# Altium schematic sheet Host-Interface.SchDoc: Shepherd - Host Interface
size 381 x 241 mm; Author: Ingmar; CompanyName: NES Lab / TU Dresden; DocumentNumber: 3; SheetNumber: 3; SheetTotal: 8
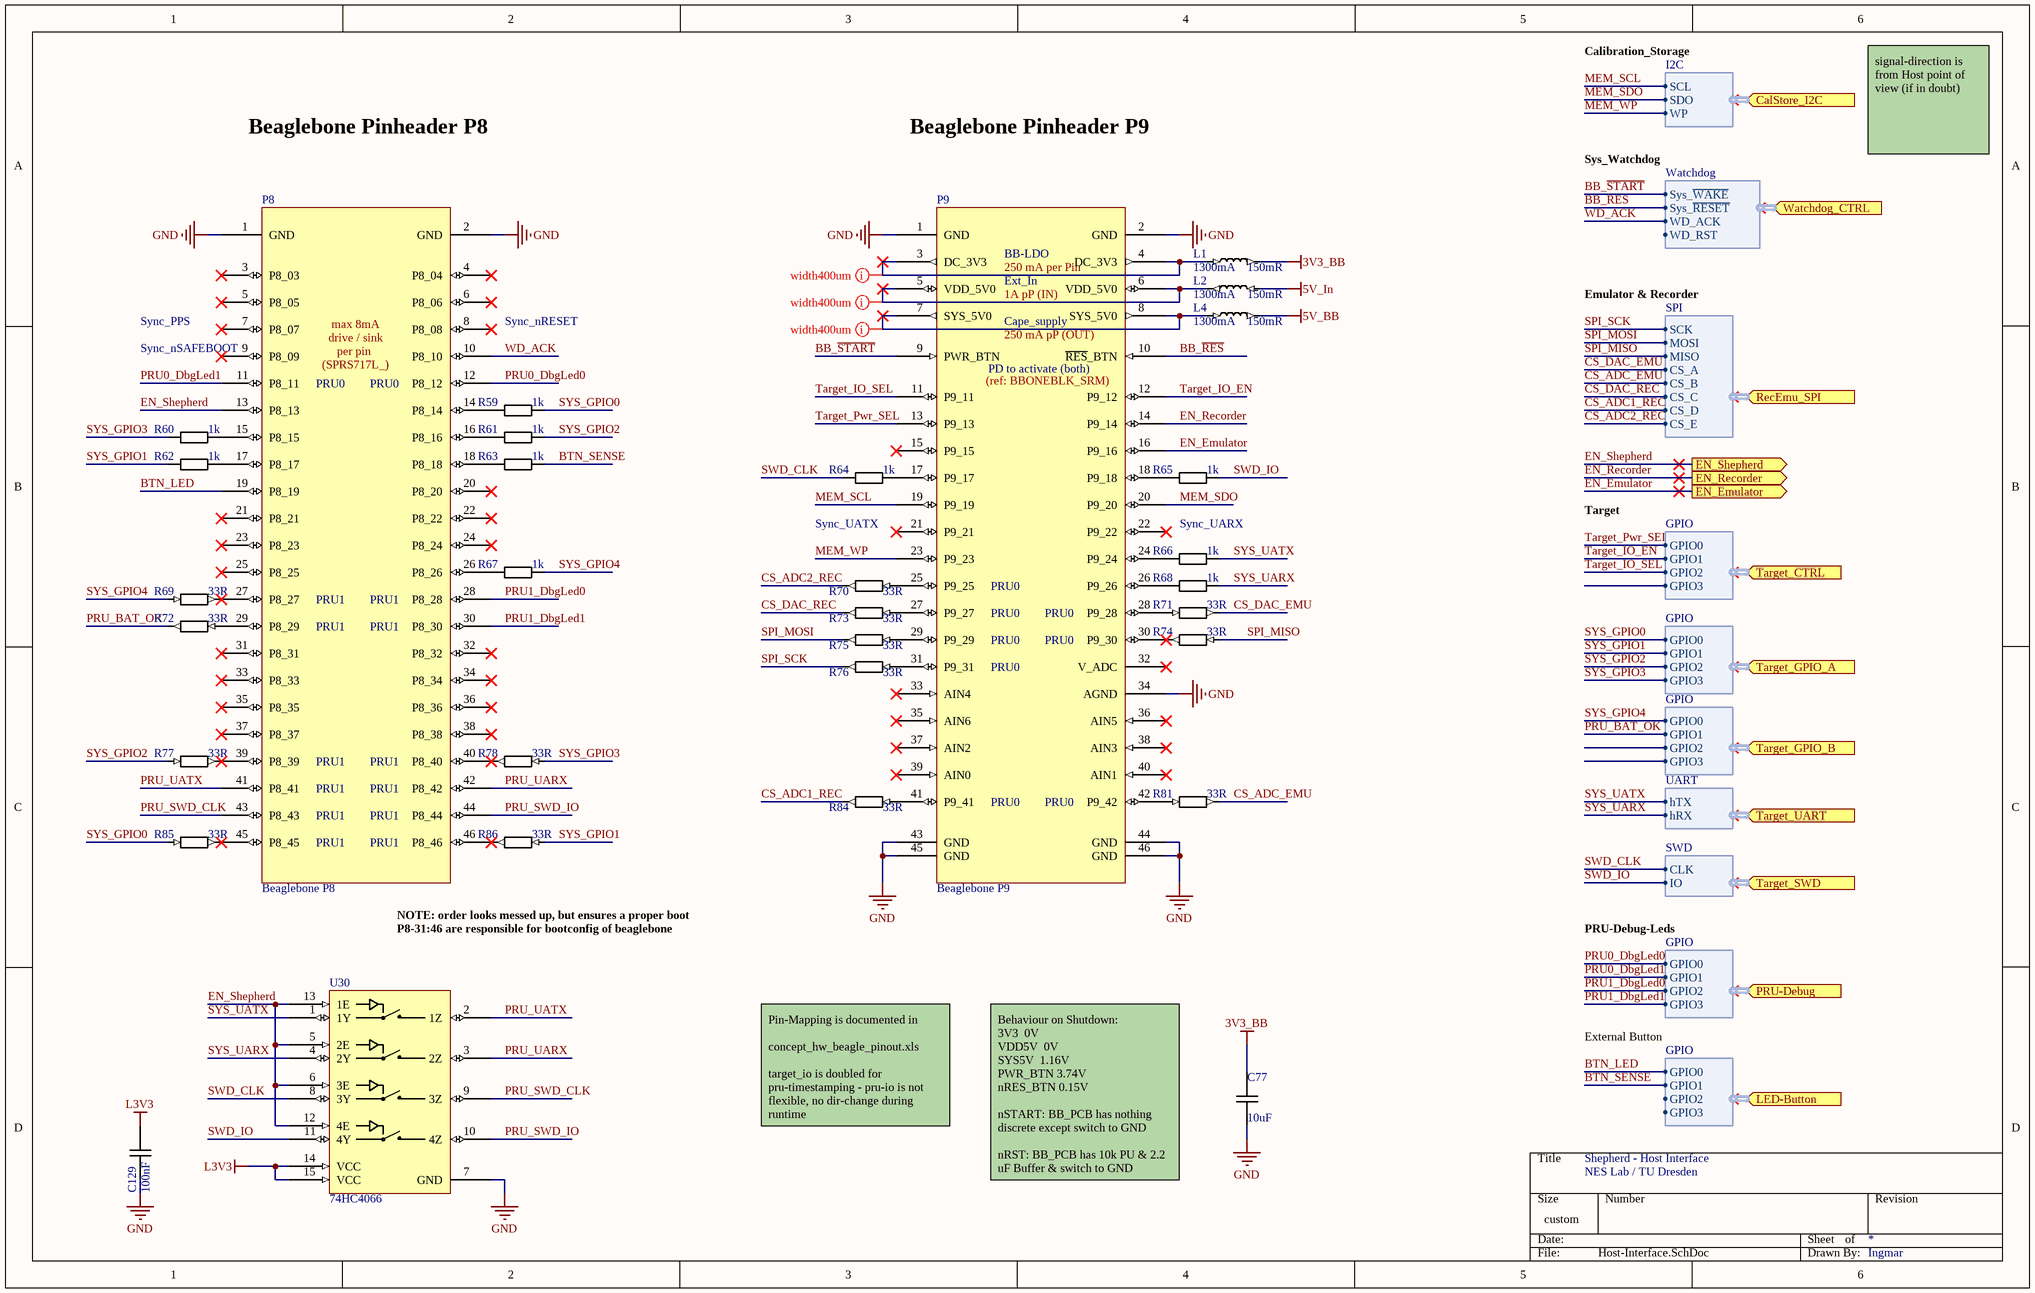
[diagram p0: Host-Interface.SchDoc]

## Parts
C77  value 10uF  [CAPC1608X09]  (hidden comment: C_0603_10uF_16V)
C129  value 100nF  [CAPC1005X06]  (hidden comment: C_0402_100nF_16V)
L1  value 150mR  I_max: 1300mA  [INDC1608X08]  (hidden comment: FB_0603_Z600R_1300mA)
L2  value 150mR  I_max: 1300mA  [INDC1608X08]  (hidden comment: FB_0603_Z600R_1300mA)
L4  value 150mR  I_max: 1300mA  [INDC1608X08]  (hidden comment: FB_0603_Z600R_1300mA)
P8  Beaglebone P8  [P_Pinheader_2x23_R2.54mm_LongPinHeader]
P9  Beaglebone P9  [P_Pinheader_2x23_R2.54mm_LongPinHeader]
R59  value 1k  [RESC1005X04]  (hidden comment: R_0402_1k)
R60  value 1k  [RESC1005X04]  (hidden comment: R_0402_1k)
R61  value 1k  [RESC1005X04]  (hidden comment: R_0402_1k)
R62  value 1k  [RESC1005X04]  (hidden comment: R_0402_1k)
R63  value 1k  [RESC1005X04]  (hidden comment: R_0402_1k)
R64  value 1k  [RESC1005X04]  (hidden comment: R_0402_1k)
R65  value 1k  [RESC1005X04]  (hidden comment: R_0402_1k)
R66  value 1k  [RESC1005X04]  (hidden comment: R_0402_1k)
R67  value 1k  [RESC1005X04]  (hidden comment: R_0402_1k)
R68  value 1k  [RESC1005X04]  (hidden comment: R_0402_1k)
R69  value 33R  [RESC1005X04]  (hidden comment: R_0402_33R)
R70  value 33R  [RESC1005X04]  (hidden comment: R_0402_33R)
R71  value 33R  [RESC1005X04]  (hidden comment: R_0402_33R)
R72  value 33R  [RESC1005X04]  (hidden comment: R_0402_33R)
R73  value 33R  [RESC1005X04]  (hidden comment: R_0402_33R)
R74  value 33R  [RESC1005X04]  (hidden comment: R_0402_33R)
R75  value 33R  [RESC1005X04]  (hidden comment: R_0402_33R)
R76  value 33R  [RESC1005X04]  (hidden comment: R_0402_33R)
R77  value 33R  [RESC1005X04]  (hidden comment: R_0402_33R)
R78  value 33R  [RESC1005X04]  (hidden comment: R_0402_33R)
R81  value 33R  [RESC1005X04]  (hidden comment: R_0402_33R)
R84  value 33R  [RESC1005X04]  (hidden comment: R_0402_33R)
R85  value 33R  [RESC1005X04]  (hidden comment: R_0402_33R)
R86  value 33R  [RESC1005X04]  (hidden comment: R_0402_33R)
U30  74HC4066  [PQFN50P250X300X100_HS-15N]

## Ports
CalStore_I2C (in, harness I2C), EN_Emulator (out), EN_Recorder (out), EN_Shepherd (out), LED-Button (in, harness GPIO), PRU-Debug (in, harness GPIO), RecEmu_SPI (in, harness SPI), Target_CTRL (in, harness GPIO), Target_GPIO_A (in, harness GPIO), Target_GPIO_B (in, harness GPIO), Target_SWD (in, harness SWD), Target_UART (in, harness UART), Watchdog_CTRL (in, harness Watchdog)

## Harnesses
GPIO: GPIO0, GPIO1, GPIO2, GPIO3
SWD: CLK, IO
UART: hTX, hRX
I2C: SCL, SDO, WP
SPI: SCK, MOSI, MISO, CS_A, CS_B, CS_C, CS_D, CS_E
Watchdog: Sys_~{WAKE}, Sys_~{RESET}, WD_ACK, WD_RST

## Nets
3V3_BB: C77.2 L1.2
5V_BB: L4.2
5V_In: L2.1
GND: C77.1 C129.2 P8.1(GND) P8.2(GND) P9.1(GND) P9.2(GND) P9.34(AGND) P9.43(GND) P9.44(GND) P9.45(GND) P9.46(GND) U30.7(GND)
L3V3: C129.1 U30.14(VCC) U30.15(VCC)
BB_~{RES}: P9.10(~{RES}_BTN) ; port Watchdog_CTRL.Sys_~{RESET}
BB_~{START}: P9.9(PWR_BTN) ; port Watchdog_CTRL.Sys_~{WAKE}
BTN_LED: P8.19(P8_19) ; port LED-Button.GPIO0
BTN_SENSE: R63.2 ; port LED-Button.GPIO1
CS_ADC1_REC: R84.2 ; port RecEmu_SPI.CS_D
CS_ADC2_REC: R70.2 ; port RecEmu_SPI.CS_E
CS_ADC_EMU: R81.2 ; port RecEmu_SPI.CS_B
CS_DAC_EMU: R71.2 ; port RecEmu_SPI.CS_A
CS_DAC_REC: R73.2 ; port RecEmu_SPI.CS_C
EN_Emulator: P9.16(P9_16) ; port EN_Emulator
EN_Recorder: P9.14(P9_14) ; port EN_Recorder
EN_Shepherd: P8.13(P8_13) U30.5(2E) U30.6(3E) U30.12(4E) U30.13(1E) ; port EN_Shepherd
MEM_SCL: P9.19(P9_19) ; port CalStore_I2C.SCL
MEM_SDO: P9.20(P9_20) ; port CalStore_I2C.SDO
MEM_WP: P9.23(P9_23) ; port CalStore_I2C.WP
PRU0_DbgLed0: P8.12(P8_12) ; port PRU-Debug.GPIO0
PRU0_DbgLed1: P8.11(P8_11) ; port PRU-Debug.GPIO1
PRU1_DbgLed0: P8.28(P8_28) ; port PRU-Debug.GPIO2
PRU1_DbgLed1: P8.30(P8_30) ; port PRU-Debug.GPIO3
PRU_BAT_OK: R72.2 ; port Target_GPIO_B.GPIO1
PRU_SWD_CLK: P8.43(P8_43) U30.9(3Z)
PRU_SWD_IO: P8.44(P8_44) U30.10(4Z)
PRU_UARX: P8.42(P8_42) U30.3(2Z)
PRU_UATX: P8.41(P8_41) U30.2(1Z)
SPI_MISO: R74.1 ; port RecEmu_SPI.MISO
SPI_MOSI: R75.2 ; port RecEmu_SPI.MOSI
SPI_SCK: R76.2 ; port RecEmu_SPI.SCK
SWD_CLK: R64.1 U30.8(3Y) ; port Target_SWD.CLK
SWD_IO: R65.2 U30.11(4Y) ; port Target_SWD.IO
SYS_GPIO0: R59.2 R85.1 ; port Target_GPIO_A.GPIO0
SYS_GPIO1: R62.1 R86.1 ; port Target_GPIO_A.GPIO1
SYS_GPIO2: R61.2 R77.1 ; port Target_GPIO_A.GPIO2
SYS_GPIO3: R60.1 R78.1 ; port Target_GPIO_A.GPIO3
SYS_GPIO4: R67.2 R69.1 ; port Target_GPIO_B.GPIO0
SYS_UARX: R68.2 U30.4(2Y) ; port Target_UART.hRX
SYS_UATX: R66.2 U30.1(1Y) ; port Target_UART.hTX
Target_IO_EN: P9.12(P9_12) ; port Target_CTRL.GPIO1
Target_IO_SEL: P9.11(P9_11) ; port Target_CTRL.GPIO2
Target_Pwr_SEL: P9.13(P9_13) ; port Target_CTRL.GPIO0
WD_ACK: P8.10(P8_10) ; port Watchdog_CTRL.WD_ACK
NetL1_1: L1.1 P9.3(DC_3V3) P9.4(DC_3V3)
NetL2_2: L2.2 P9.5(VDD_5V0) P9.6(VDD_5V0)
NetL4_1: L4.1 P9.7(SYS_5V0) P9.8(SYS_5V0)
NetP8_14: P8.14(P8_14) R59.1
NetP8_15: P8.15(P8_15) R60.2
NetP8_16: P8.16(P8_16) R61.1
NetP8_17: P8.17(P8_17) R62.2
NetP8_18: P8.18(P8_18) R63.1
NetP8_26: P8.26(P8_26) R67.1
NetP8_27: P8.27(P8_27) R69.2
NetP8_29: P8.29(P8_29) R72.1
NetP8_39: P8.39(P8_39) R77.2
NetP8_40: P8.40(P8_40) R78.2
NetP8_45: P8.45(P8_45) R85.2
NetP8_46: P8.46(P8_46) R86.2
NetP9_17: P9.17(P9_17) R64.2
NetP9_18: P9.18(P9_18) R65.1
NetP9_24: P9.24(P9_24) R66.1
NetP9_25: P9.25(P9_25) R70.1
NetP9_26: P9.26(P9_26) R68.1
NetP9_27: P9.27(P9_27) R73.1
NetP9_28: P9.28(P9_28) R71.1
NetP9_29: P9.29(P9_29) R75.1
NetP9_30: P9.30(P9_30) R74.2
NetP9_31: P9.31(P9_31) R76.1
NetP9_41: P9.41(P9_41) R84.1
NetP9_42: P9.42(P9_42) R81.1

Not connected (* = marked no-connect by the designer): P8 3(P8_03)* 4(P8_04)* 5(P8_05)* 6(P8_06)* 7(P8_07)* 8(P8_08)* 9(P8_09)* 20(P8_20)* 21(P8_21)* 22(P8_22)* 23(P8_23)* 24(P8_24)* 25(P8_25)* 31(P8_31)* 32(P8_32)* 33(P8_33)* 34(P8_34)* 35(P8_35)* 36(P8_36)* 37(P8_37)* 38(P8_38)*; P9 15(P9_15)* 21(P9_21)* 22(P9_22)* 32(V_ADC)* 33(AIN4)* 35(AIN6)* 36(AIN5)* 37(AIN2)* 38(AIN3)* 39(AIN0)* 40(AIN1)*

## Layout directives
rule Width Constraint [Pref Width = 0.4mm    Min Width = 0.4mm    Max Width = 1mm]: NetL1_1, NetL2_2, NetL4_1

## Notes on the sheet
- Calibration_Storage
- Beaglebone Pinheader P8
- Beaglebone Pinheader P9
- Sys_Watchdog
- signal-direction is from Host point of view (if in doubt)
- Emulator & Recorder
- Sync_PPS
- (near P8) Sync_nSAFEBOOT
- Sync_nRESET
- (near P8) PRU0
- Sync_UATX
- Sync_UARX
- Target
- (near P8) PRU1
- (near P9) PRU0
- NOTE: order looks messed up, but ensures a proper boot
- P8-31:46 are responsible for bootconfig of beaglebone
- PRU-Debug-Leds
- External Button
- Pin-Mapping is documented in
  concept_hw_beagle_pinout.xls
  target_io is doubled for pru-timestamping - pru-io is not flexible, no dir-change during runtime
- Behaviour on Shutdown:
  3V3		0V
  VDD5V		0V
  SYS5V		1.16V
  PWR_BTN	3.74V
  nRES_BTN	0.15V
  nSTART: BB_PCB has nothing discrete except switch to GND
  nRST: BB_PCB has 10k PU & 2.2 uF Buffer & switch to GND
- (in symbol Beaglebone P8) max 8mA / drive / sink / per pin / (SPRS717L_)
- (in symbol Beaglebone P9) BB-LDO; 250 mA per Pin; Ext_In; 1A pP (IN); Cape_supply; 250 mA pP (OUT); PD to activate (both); (ref: BBONEBLK_SRM)

## Library data of the parts
C77 = .C_0603_10uF_16V: Capacitor; Manufacturer: Taiyo Yuden; Manufacturer PN: EMK107BBJ106MA-T; V_max: 16V; Tolerance: 20%; Dielectric: X5R; Distributer: Mouser; Distributer PN: 963-EMK107BBJ106MA-T; Price n10 [€]: 0.14
C129 = .C_0402_100nF_16V: Capacitor; Manufacturer: Taiyo Yuden; Manufacturer PN: EMF105B7104MVHF; V_max: 16V; Tolerance: 20%; Dielectric: X7R; Distributer: Mouser; Distributer PN: 963-EMF105B7104MVHF; Price n10 [€]: 0.03
L1 L2 L4 = .L_FB_0603_Z600R_1300mA: Ferrite Bead, 600 Ohm @ 100 MHz,; Manufacturer: Murata; Manufacturer PN: BLM18KG601SN1D; Tolerance: 25 %; Distributer: Mouser; Distributer PN: 81-BLM18KG601SN1D; Price n10 [€]: 0.05
P8 = Beaglebone P8: Manufacturer: Samtec; Manufacturer PN: SSQ-123-03-G-D; Distributer: Digikey; Distributer PN: SAM1196-23-ND; Price n10 [€]: 6.45
P9 = Beaglebone P9: Manufacturer: Samtec; Manufacturer PN: SSQ-123-03-G-D; Distributer: Digikey; Distributer PN: SAM1196-23-ND; Price n10 [€]: 6.45
R59-R68 = .R_0402_1k: Resistor; Manufacturer: Panasonic; Manufacturer PN: ERJ-2GEJ102X; P_max: 100mW; V_max: 50V; Tolerance: 5%; Distributer: Mouser; Distributer PN: 667-ERJ-2GEJ102X; Price n10 [€]: 0.02
R69-R78 R81 R84-R86 = .R_0402_33R: Resistor; Manufacturer: Panasonic; Manufacturer PN: ERJ-2GEJ330X; P_max: 100mW; V_max: 50V; Tolerance: 5%; Distributer: Mouser; Distributer PN: 667-ERJ-2GEJ330X; Price n10 [€]: 0.02
U30 = 74HC4066BQ: Quad single-pole single-throw analog switch, CMOS; Manufacturer: Nexperia; Manufacturer PN: 74HC4066BQ,115; R_min: 50 Ohm; V_max: 10V; V_min: 2V; Distributer: Mouser; Distributer PN: 771-HC4066BQ115; Price n10 [€]: 0.27